# Altium schematic sheet QCPower Rev A Sht0 Top Level.SchDoc
size A3
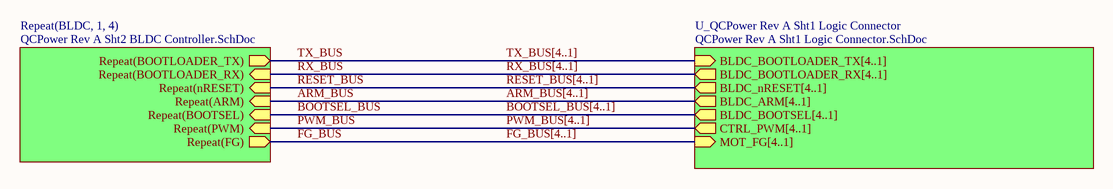
[diagram p0: QCPower Rev A Sht0 Top Level.SchDoc]

## Sub-sheets
Repeat(BLDC, 1, 4) = QCPower Rev A Sht2 BLDC Controller.SchDoc: Repeat(PWM) (in), Repeat(BOOTLOADER_RX) (in), Repeat(BOOTLOADER_TX) (out), Repeat(BOOTSEL) (in), Repeat(nRESET) (in), Repeat(ARM) (in), Repeat(FG) (out)
U_QCPower Rev A Sht1 Logic Connector = QCPower Rev A Sht1 Logic Connector.SchDoc: CTRL_PWM[4..1] (out), BLDC_BOOTLOADER_TX[4..1] (in), BLDC_nRESET[4..1] (out), BLDC_BOOTLOADER_RX[4..1] (out), BLDC_BOOTSEL[4..1] (out), BLDC_ARM[4..1] (out), MOT_FG[4..1] (in)

## Nets
ARM_BUS: sheet Repeat(BLDC, 1, 4)/Repeat(ARM)
BOOTSEL_BUS: sheet Repeat(BLDC, 1, 4)/Repeat(BOOTSEL)
FG_BUS: sheet Repeat(BLDC, 1, 4)/Repeat(FG)
PWM_BUS: sheet Repeat(BLDC, 1, 4)/Repeat(PWM)
RESET_BUS: sheet Repeat(BLDC, 1, 4)/Repeat(nRESET)
RX_BUS: sheet Repeat(BLDC, 1, 4)/Repeat(BOOTLOADER_RX)
TX_BUS: sheet Repeat(BLDC, 1, 4)/Repeat(BOOTLOADER_TX)

## Buses and harness runs
bus ARM_BUS[4..1] = sheet U_QCPower Rev A Sht1 Logic Connector/BLDC_ARM[4..1]
bus BOOTSEL_BUS[4..1] = sheet U_QCPower Rev A Sht1 Logic Connector/BLDC_BOOTSEL[4..1]
bus FG_BUS[4..1] = sheet U_QCPower Rev A Sht1 Logic Connector/MOT_FG[4..1]
bus PWM_BUS[4..1] = sheet U_QCPower Rev A Sht1 Logic Connector/CTRL_PWM[4..1]
bus RESET_BUS[4..1] = sheet U_QCPower Rev A Sht1 Logic Connector/BLDC_nRESET[4..1]
bus RX_BUS[4..1] = sheet U_QCPower Rev A Sht1 Logic Connector/BLDC_BOOTLOADER_RX[4..1]
bus TX_BUS[4..1] = sheet U_QCPower Rev A Sht1 Logic Connector/BLDC_BOOTLOADER_TX[4..1]